# Altium schematic sheet 04_PCIe_VL805.SchDoc: PCI-e to USB3 Hub
size A2; Organization: Greenfield Tech Solutions; Address1: Molendreef 33; Address2: Ossendrecht; Address3: 4641CS; Address4: The Netherlands; SheetNumber: 4; SheetTotal: 11
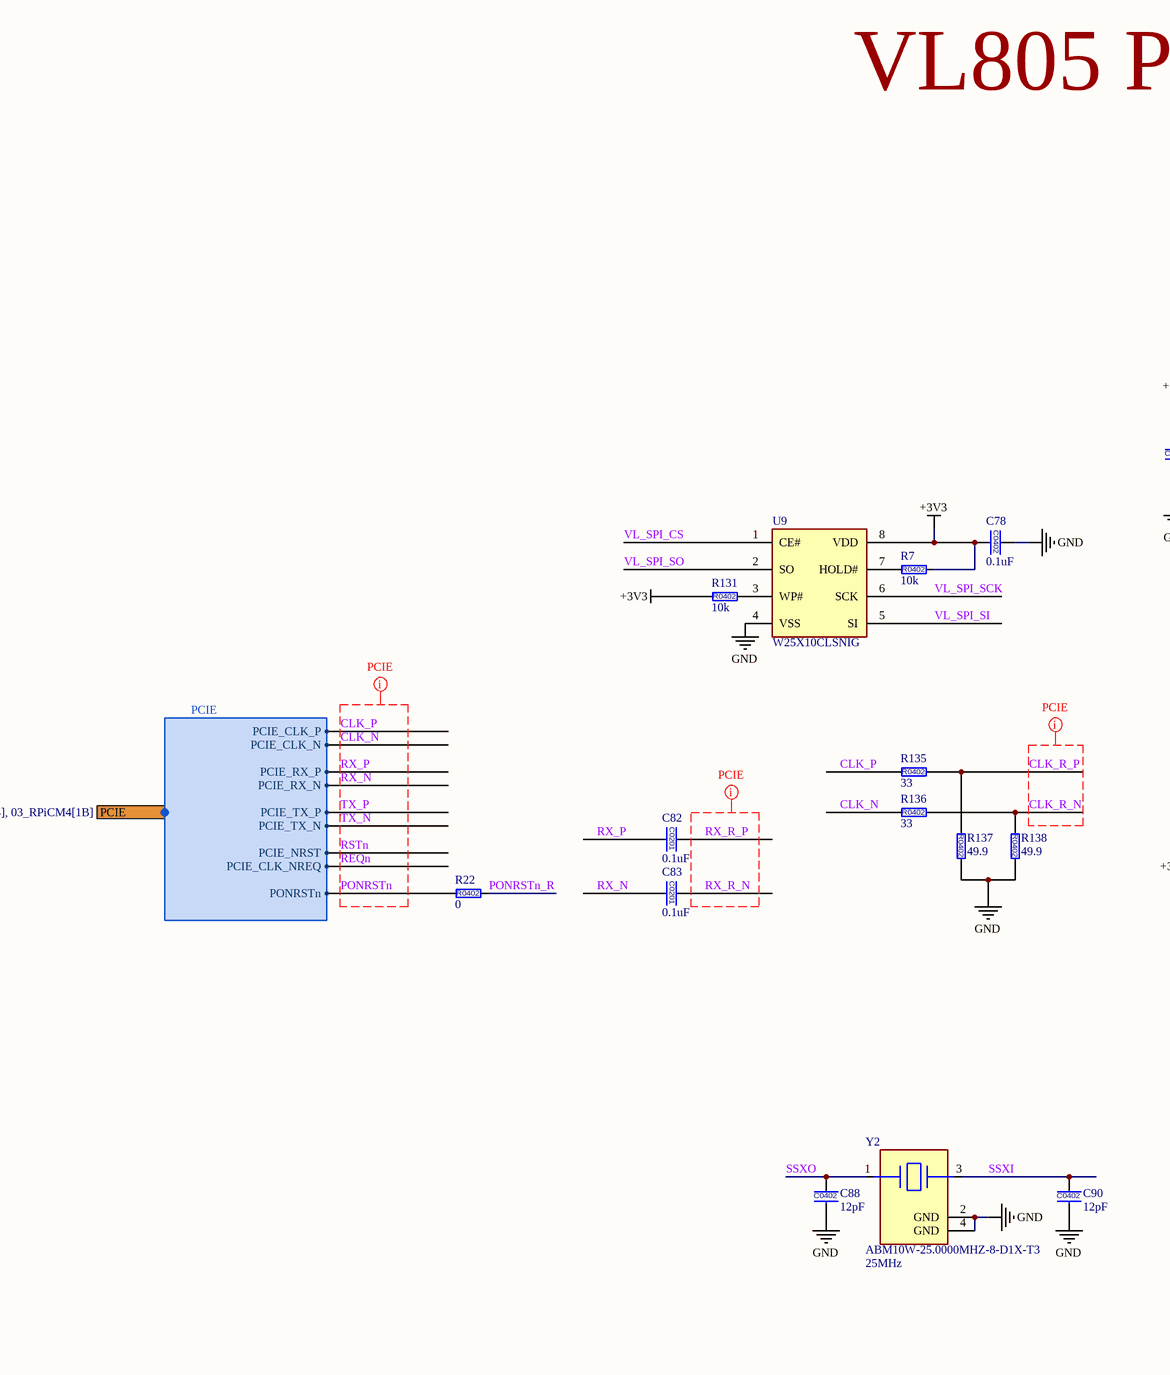
[diagram p0: 04_PCIe_VL805.SchDoc, left]
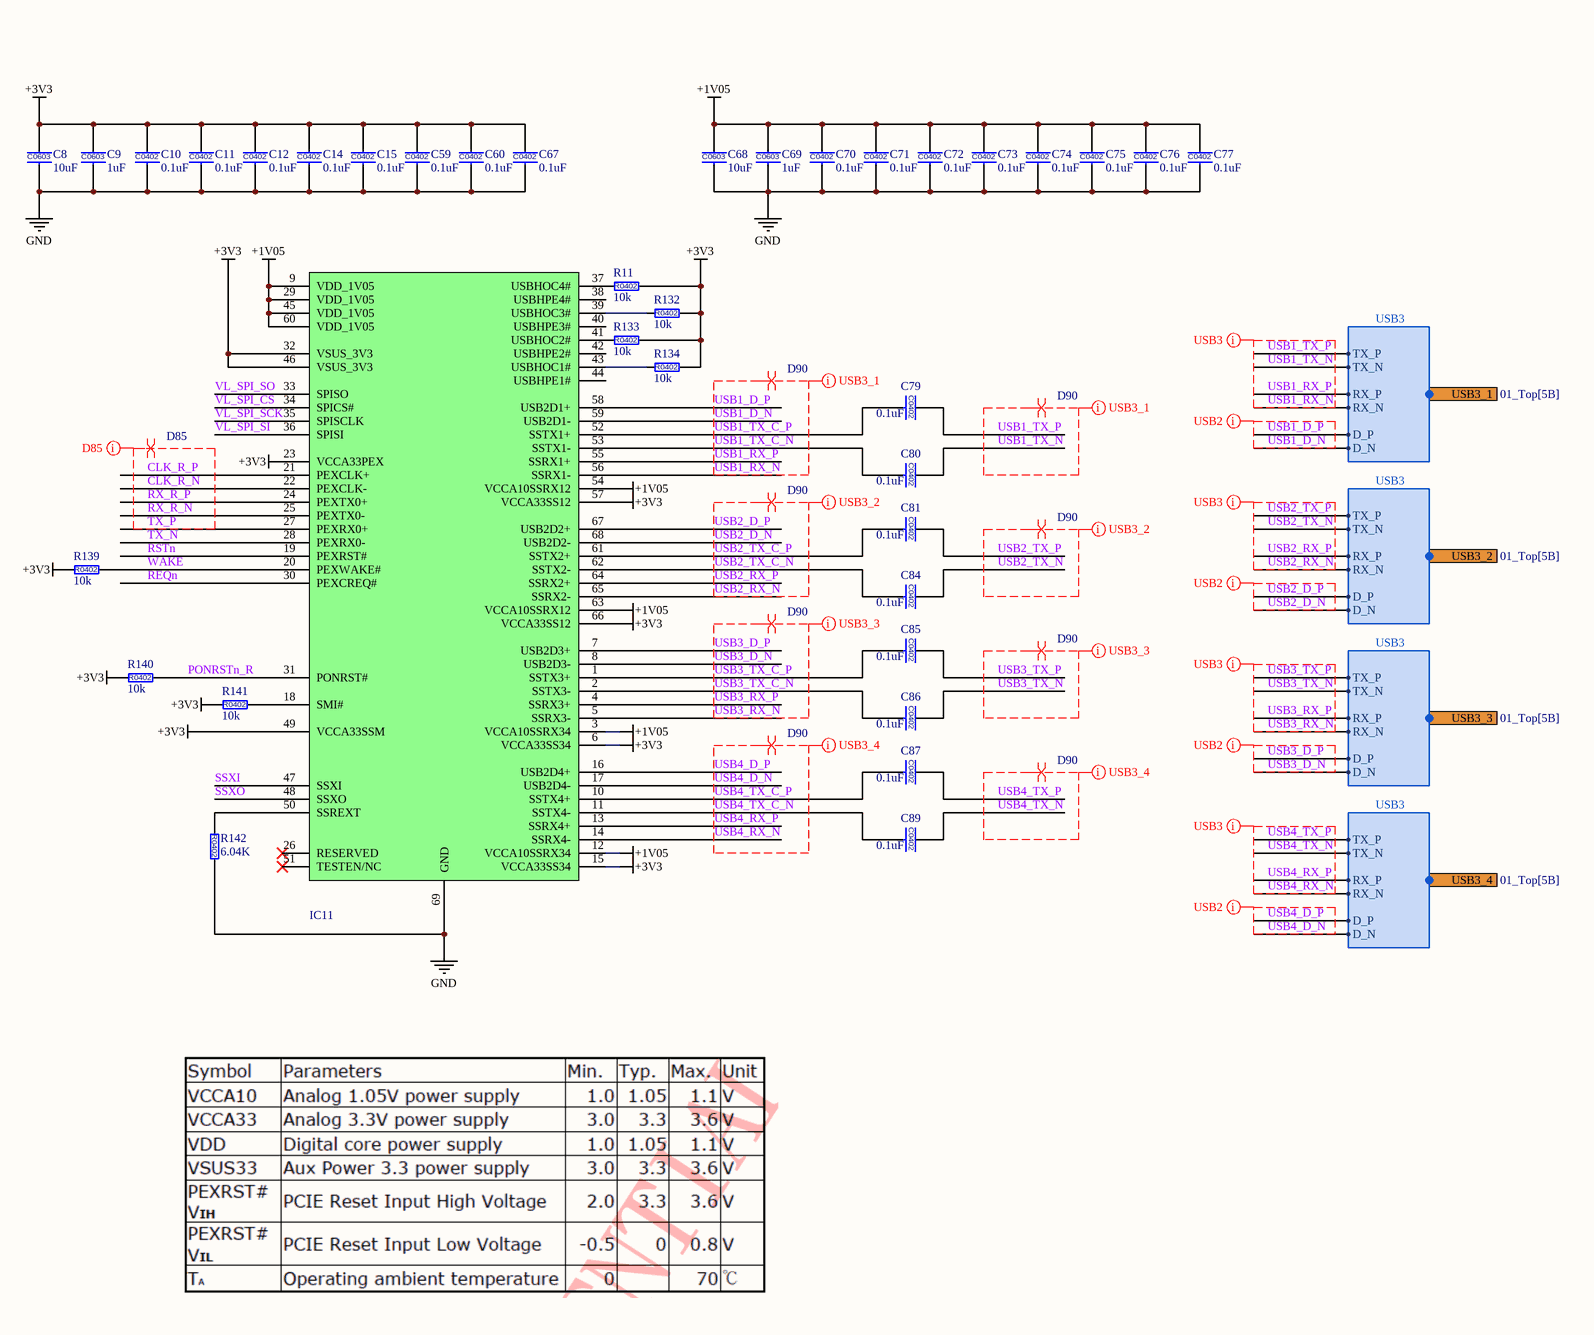
[diagram p1: 04_PCIe_VL805.SchDoc, right]

## Parts
C8  10uF  [C0603]
C9  1uF  [C0603]
C10  0.1uF  [C0402]
C11  0.1uF  [C0402]
C12  0.1uF  [C0402]
C14  0.1uF  [C0402]
C15  0.1uF  [C0402]
C59  0.1uF  [C0402]
C60  0.1uF  [C0402]
C67  0.1uF  [C0402]
C68  10uF  [C0603]
C69  1uF  [C0603]
C70  0.1uF  [C0402]
C71  0.1uF  [C0402]
C72  0.1uF  [C0402]
C73  0.1uF  [C0402]
C74  0.1uF  [C0402]
C75  0.1uF  [C0402]
C76  0.1uF  [C0402]
C77  0.1uF  [C0402]
C78  0.1uF  [C0402]
C79  0.1uF  [C0402]
C80  0.1uF  [C0402]
C81  0.1uF  [C0402]
C82  0.1uF  [C0201]
C83  0.1uF  [C0201]
C84  0.1uF  [C0402]
C85  0.1uF  [C0402]
C86  0.1uF  [C0402]
C87  0.1uF  [C0402]
C88  12pF  [C0402]
C89  0.1uF  [C0402]
C90  12pF  [C0402]
IC11  VL805-Q6  [VL805-Q6_QFN-68G]  (value not drawn)
R7  10k  [R0402]
R11  10k  [R0402]
R22  0  [R0402]
R131  10k  [R0402]
R132  10k  [R0402]
R133  10k  [R0402]
R134  10k  [R0402]
R135  33  [R0402]
R136  33  [R0402]
R137  49.9  [R0402]
R138  49.9  [R0402]
R139  10k  [R0402]
R140  10k  [R0402]
R141  10k  [R0402]
R142  6.04K  [R0402]
U9  W25X10CLSNIG  [W25X10CLSNIG_SOIC_8]
Y2  ABM10W-25.0000MHZ-8-D1X-T3  Frequency: 25MHz  [ABM10W]

## Ports
PCIE (harness PCIE, see 01_Top[5B], 03_RPiCM4[1B]), USB3_1 (harness USB3, see 01_Top[5B]), USB3_2 (harness USB3, see 01_Top[5B]), USB3_3 (harness USB3, see 01_Top[5B]), USB3_4 (harness USB3, see 01_Top[5B])

## Harnesses
PCIE: PCIE_CLK_NREQ, PCIE_CLK_P, PCIE_CLK_N, PCIE_NRST, PCIE_RX_P, PCIE_TX_P, PCIE_RX_N, PCIE_TX_N, PONRSTn
USB3: TX_P, TX_N, RX_P, RX_N, D_P, D_N

## Nets
+1V05: C68.1 C69.1 C70.1 C71.1 C72.1 C73.1 C74.1 C75.1 C76.1 C77.1 IC11.3(VCCA10SSRX34) IC11.9(VDD_1V05) IC11.12(VCCA10SSRX34) IC11.29(VDD_1V05) IC11.45(VDD_1V05) IC11.54(VCCA10SSRX12) IC11.60(VDD_1V05) IC11.63(VCCA10SSRX12)
+3V3: C8.1 C9.1 C10.1 C11.1 C12.1 C14.1 C15.1 C59.1 C60.1 C67.1 C78.2 IC11.6(VCCA33SS34) IC11.15(VCCA33SS34) IC11.23(VCCA33PEX) IC11.32(VSUS_3V3) IC11.46(VSUS_3V3) IC11.49(VCCA33SSM) IC11.57(VCCA33SS12) IC11.66(VCCA33SS12) R7.2 R11.2 R131.1 R132.2 R133.2 R134.2 R139.1 R140.1 R141.1 U9.8(VDD)
GND: C8.2 C9.2 C10.2 C11.2 C12.2 C14.2 C15.2 C59.2 C60.2 C67.2 C68.2 C69.2 C70.2 C71.2 C72.2 C73.2 C74.2 C75.2 C76.2 C77.2 C78.1 C88.2 C90.2 IC11.69(GND) R137.2 R138.2 R142.2 U9.4(VSS) Y2.2(GND) Y2.4(GND)
CLK_N: R136.1 ; port PCIE.PCIE_CLK_N
CLK_P: R135.1 ; port PCIE.PCIE_CLK_P
CLK_R_N: IC11.22(PEXCLK-) R136.2 R138.1
CLK_R_P: IC11.21(PEXCLK+) R135.2 R137.1
PONRSTn: R22.1 ; port PCIE.PONRSTn
PONRSTn_R: IC11.31(PONRST#) R22.2 R140.2
REQn: IC11.30(PEXCREQ#) ; port PCIE.PCIE_CLK_NREQ
RSTn: IC11.19(PEXRST#) ; port PCIE.PCIE_NRST
RX_N: C83.2 ; port PCIE.PCIE_RX_N
RX_P: C82.2 ; port PCIE.PCIE_RX_P
RX_R_N: C83.1 IC11.25(PEXTX0-)
RX_R_P: C82.1 IC11.24(PEXTX0+)
SSXI: C90.1 IC11.47(SSXI) Y2.3
SSXO: C88.1 IC11.48(SSXO) Y2.1
TX_N: IC11.28(PEXRX0-) ; port PCIE.PCIE_TX_N
TX_P: IC11.27(PEXRX0+) ; port PCIE.PCIE_TX_P
USB1_D_N: IC11.59(USB2D1-) ; port USB3_1.D_N
USB1_D_P: IC11.58(USB2D1+) ; port USB3_1.D_P
USB1_RX_N: IC11.56(SSRX1-) ; port USB3_1.RX_N
USB1_RX_P: IC11.55(SSRX1+) ; port USB3_1.RX_P
USB1_TX_C_N: C80.2 IC11.53(SSTX1-)
USB1_TX_C_P: C79.2 IC11.52(SSTX1+)
USB1_TX_N: C80.1 ; port USB3_1.TX_N
USB1_TX_P: C79.1 ; port USB3_1.TX_P
USB2_D_N: IC11.68(USB2D2-) ; port USB3_2.D_N
USB2_D_P: IC11.67(USB2D2+) ; port USB3_2.D_P
USB2_RX_N: IC11.65(SSRX2-) ; port USB3_2.RX_N
USB2_RX_P: IC11.64(SSRX2+) ; port USB3_2.RX_P
USB2_TX_C_N: C84.2 IC11.62(SSTX2-)
USB2_TX_C_P: C81.2 IC11.61(SSTX2+)
USB2_TX_N: C84.1 ; port USB3_2.TX_N
USB2_TX_P: C81.1 ; port USB3_2.TX_P
USB3_D_N: IC11.8(USB2D3-) ; port USB3_3.D_N
USB3_D_P: IC11.7(USB2D3+) ; port USB3_3.D_P
USB3_RX_N: IC11.5(SSRX3-) ; port USB3_3.RX_N
USB3_RX_P: IC11.4(SSRX3+) ; port USB3_3.RX_P
USB3_TX_C_N: C86.2 IC11.2(SSTX3-)
USB3_TX_C_P: C85.2 IC11.1(SSTX3+)
USB3_TX_N: C86.1 ; port USB3_3.TX_N
USB3_TX_P: C85.1 ; port USB3_3.TX_P
USB4_D_N: IC11.17(USB2D4-) ; port USB3_4.D_N
USB4_D_P: IC11.16(USB2D4+) ; port USB3_4.D_P
USB4_RX_N: IC11.14(SSRX4-) ; port USB3_4.RX_N
USB4_RX_P: IC11.13(SSRX4+) ; port USB3_4.RX_P
USB4_TX_C_N: C89.2 IC11.11(SSTX4-)
USB4_TX_C_P: C87.2 IC11.10(SSTX4+)
USB4_TX_N: C89.1 ; port USB3_4.TX_N
USB4_TX_P: C87.1 ; port USB3_4.TX_P
VL_SPI_CS: IC11.34(SPICS#) U9.1(CE#)
VL_SPI_SCK: IC11.35(SPISCLK) U9.6(SCK)
VL_SPI_SI: IC11.36(SPISI) U9.5(SI)
VL_SPI_SO: IC11.33(SPISO) U9.2(SO)
WAKE: IC11.20(PEXWAKE#) R139.2
NetIC11_18: IC11.18(SMI#) R141.2
NetIC11_37: IC11.37(USBHOC4#) R11.1
NetIC11_39: IC11.39(USBHOC3#) R132.1
NetIC11_41: IC11.41(USBHOC2#) R133.1
NetIC11_43: IC11.43(USBHOC1#) R134.1
NetIC11_50: IC11.50(SSREXT) R142.1
NetR7_1: R7.1 U9.7(HOLD#)
NetR131_2: R131.2 U9.3(WP#)

Not connected (* = marked no-connect by the designer): IC11 26(RESERVED)* 38(USBHPE4#) 40(USBHPE3#) 42(USBHPE2#) 44(USBHPE1#) 51(TESTEN/NC)*

## Layout directives
net class PCIE: CLK_N, CLK_P, CLK_R_N, CLK_R_P, PONRSTn, REQn, RSTn, RX_N, RX_P, RX_R_N, RX_R_P, TX_N, TX_P
differential pair; differential pair class D85: CLK_R_N, CLK_R_P, RX_R_N, RX_R_P, TX_P
net class D85: CLK_R_N, CLK_R_P, RX_R_N, RX_R_P, TX_P
net class USB3_1: USB1_D_N, USB1_D_P, USB1_RX_N, USB1_RX_P, USB1_TX_C_N, USB1_TX_C_P, USB1_TX_N, USB1_TX_P
net class USB3_2: USB2_D_N, USB2_D_P, USB2_RX_N, USB2_RX_P, USB2_TX_C_N, USB2_TX_C_P, USB2_TX_N, USB2_TX_P
net class USB3_3: USB3_D_N, USB3_D_P, USB3_RX_N, USB3_RX_P, USB3_TX_C_N, USB3_TX_C_P, USB3_TX_N, USB3_TX_P
net class USB3_4: USB4_D_N, USB4_D_P, USB4_RX_N, USB4_RX_P, USB4_TX_C_N, USB4_TX_C_P, USB4_TX_N, USB4_TX_P
differential pair; differential pair class D90: USB1_D_N, USB1_D_P, USB1_RX_N, USB1_RX_P, USB1_TX_C_N, USB1_TX_C_P, USB1_TX_N, USB1_TX_P, USB2_D_N, USB2_D_P, USB2_RX_N, USB2_RX_P, USB2_TX_C_N, USB2_TX_C_P, USB2_TX_N, USB2_TX_P, USB3_D_N, USB3_D_P, USB3_RX_N, USB3_RX_P, USB3_TX_C_N, USB3_TX_C_P, USB3_TX_N, USB3_TX_P, USB4_D_N, USB4_D_P, USB4_RX_N, USB4_RX_P, USB4_TX_C_N, USB4_TX_C_P, USB4_TX_N, USB4_TX_P
net class USB3: USB1_RX_N, USB1_RX_P, USB1_TX_N, USB1_TX_P, USB2_RX_N, USB2_RX_P, USB2_TX_N, USB2_TX_P, USB3_RX_N, USB3_RX_P, USB3_TX_N, USB3_TX_P, USB4_RX_N, USB4_RX_P, USB4_TX_N, USB4_TX_P
net class USB2: USB1_D_N, USB1_D_P, USB2_D_N, USB2_D_P, USB3_D_N, USB3_D_P, USB4_D_N, USB4_D_P

## Notes on the sheet
- VL805 PCIe USB3 Controller
- Title
- Size:
- Date:
- File:
- A2
- Number:
- Time:
- Revision:
- Sheet
- of
- (in symbol 0201ZD105MAT2A) C0603
- (in symbol 0603ZD106KAT2A) C0603
- (in symbol 02016D104KAT) C0201
- (in symbol 04023A120KAT2A) C0402
- (in symbol 04023D104KAT2A) C0402
- (in symbol CRCW04026K04FKEDC) R0402
- (in symbol CRCW040210K0FK) R0402
- (in symbol CRCW040233R0FKEDC) R0402
- (in symbol CRCW040249R9FKEDC) R0402
- (in symbol CRCW04020000Z0) R0402

## Library data of the parts
C8 C68 = 0603ZD106KAT2A: CAP CER 10uF 10% 10V X5R 0603; Manufacturer: KYOCERA AVX; Value: 10µF; Manufacturer Part Number: 0603ZD106KAT2A; Tolerance: ±10%; Voltage - Rated: 10V; Temperature Coefficient: X5R
C9 C69 = 0201ZD105MAT2A: CAP CER 1uF 20% 10V X5R 0603; Manufacturer: KYOCERA AVX; Value: 1uF; Tolerance: 20%; Manufacturer Part Number: 0201ZD105MAT2A
C10-C12 C14 C15 C59 C60 C67 C70-C81 C84-C87 C89 = 04023D104KAT2A: CAP CER  0.1uF 10% 25V X5R 0402; Manufacturer: AVX Corporation; Manufacturer Part Number: 04023D104KAT2A; Value: 0.1uF; Voltage - Rated: 25V; Tolerance: ±10%; Temperature Coefficient: X5R
C82 C83 = 02016D104KAT: CAP CER  0.1uF 10% 6.3V X5R 0201; Manufacturer: AVX Corporation; Capacitance: 100nF; Category: Capacitors; Manufacturer Part Number: 02016D104KAT; Operating Temperature: -55°C ~ 85°C; Package / Case: 0201; Value: 0.1uF; Voltage - Rated: 6.3V; Supplier: Digi-Key; Tolerance: ±10%; Temperature Coefficient: X5R; Mounting Type: Surface Mount, MLCC
C88 C90 = 04023A120KAT2A: CAP CER 12pF 10% 25V NP0 0402; Manufacturer: KYOCERA AVX; Capacitance: 1uF; Manufacturer Part Number: 04023A120KAT2A; Operating Temperature: -55°C ~ 85°C; Package / Case: 0402 (1005 Metric); Value: 12pF; Voltage - Rated: 25V; Tolerance: ±10%; Temperature Coefficient: NP0
IC11 = VL805-Q6: VL805 4-Port USB 3.0 Host Controller; Manufacturer: VLI; ID: 46; Manufacturer Part Number: VL805-Q6
R7 R131 = CRCW040210K0FK: RES SMD 10K ohm 1% 1/16W R0402; Manufacturer: Vishay Dale; Manufacturer Part Number: CRCW040210K0FK; Value: 10K; Power (Watts): 1/16W; Package / Case: 0402; Tolerance: ±1%
R11 R132-R134 R139-R141 = CRCW040210K0FK: RES SMD 10K ohm 1% 1/16W R0402; Manufacturer: Vishay; check: ok; Manufacturer Part Number: CRCW040210K0FK; Value: 10K; Power (Watts): 1/16W; Package / Case: 0402; Tolerance: ±1%
R22 = CRCW04020000Z0: RES SMD 0 ohm 1/16W R0402; Manufacturer: Vishay Dale; Manufacturer Part Number: CRCW04020000Z0; Value: 0; Power (Watts): 1/16W; Package / Case: 0402
R135 R136 = CRCW040233R0FKEDC: RES SMD 33 ohm 1% 1/16W R0402; Manufacturer: Vishay; check: ok; Manufacturer Part Number: CRCW040233R0FKEDC; Value: 33; Power (Watts): 1/16W; Package / Case: 0402; Tolerance: ±1%
R137 R138 = CRCW040249R9FKEDC: RES SMD 49.9 ohm 1% 1/16W R0402; Manufacturer: Vishay; check: ok; Manufacturer Part Number: CRCW040249R9FKEDC; Value: 49.9; Power (Watts): 1/16W; Package / Case: 0402; Tolerance: ±1%
R142 = CRCW04026K04FKEDC: RES SMD6.04K ohm 1% 1/16W R0402; Manufacturer: Vishay; Manufacturer Part Number: CRCW04026K04FKEDC; Value: 6.04K; Power (Watts): 1/16W; Package / Case: 0402; Tolerance: ±1%
U9 = W25X10CLSNIG: IC FLASH 1MBIT 104MHZ 8SOIC; Manufacturer: Winbond; Interface: SPI,Serial; Memory Format: FLASH,NOR; Access Time: 8ns; Address Bus Width: 24b; Density: 1Mb; Max Supply Voltage: 3.6V; Min Supply Voltage: 2.3V; Page Size: 256B; Memory Size: 128000; Nominal Supply Current: 14mA; Sync/Async: Synchronous; Supplier 1: Digi-Key; Manufacturer Part Number: W25X10CLSNIG; RoHS: Yes; Category: Flash; Mounting Technology: Surface Mount; Case/Package: SOIC; Pins: 8; Min Operating Temperature: -40°C; Max Operating Temperature: 85°C; Packaging: Rail/Tube; Frequency: 104MHz; Package Quantity: 100; Series: SpiFlash®; Access Time-Max: 8ns; Supply Current: 14mA; Radiation Hardening: No; RoHS Compliant: Yes; ComponentLink1URL: https://datasheet.ciiva.com/15126/getdatasheetpartid-650790-15126713.pdf?src-supplier=Verical; ComponentLink1Description: https://datasheet.ciiva.com/15126/getdatasheetpartid-650790-15126713.pdf?src-supplier=Verical; Supplier Part Number 1: W25X10CLSNIG-ND
Y2 = ABM10W-25.0000MHZ-8-D1X-T3: CRYSTAL 25.0000MHZ 8PF SMD, 2.5x2mm, RoHS; Manufacturer: Abracon; Frequency Tolerance: 10ppm; Frequency Stability: 20ppm; ESR (Equivalent Series Resistance): 100R; Max Operating Temperature: 85°C; Min Operating Temperature: -40°C; Case/Package: SMD/SMT; Mount: Surface Mount; Load Capacitance: 8pF; Packaging: Tape and Reel; Supplier 1: Digi-Key; Manufacturer Part Number: ABM10W-25.0000MHZ-8-D1X-T3; RoHS: No; Category: Crystals; Stock 1: 4012; Pricing 1: 1=0.73000, 10=0.60600, 50=0.54540, 100=0.48480, 500=0.46056, 1000=0.38784 (USD); Mounting Technology: Surface Mount; ComponentLink1URL: https://abracon.com/Resonators/ABM10W.pdf?src-supplier=Digi-Key; ComponentLink1Description: https://abracon.com/Resonators/ABM10W.pdf?src-supplier=Digi-Key; Supplier Part Number 1: 535-13735-1-ND